# Altium schematic sheet power.SchDoc
size 381 x 241 mm
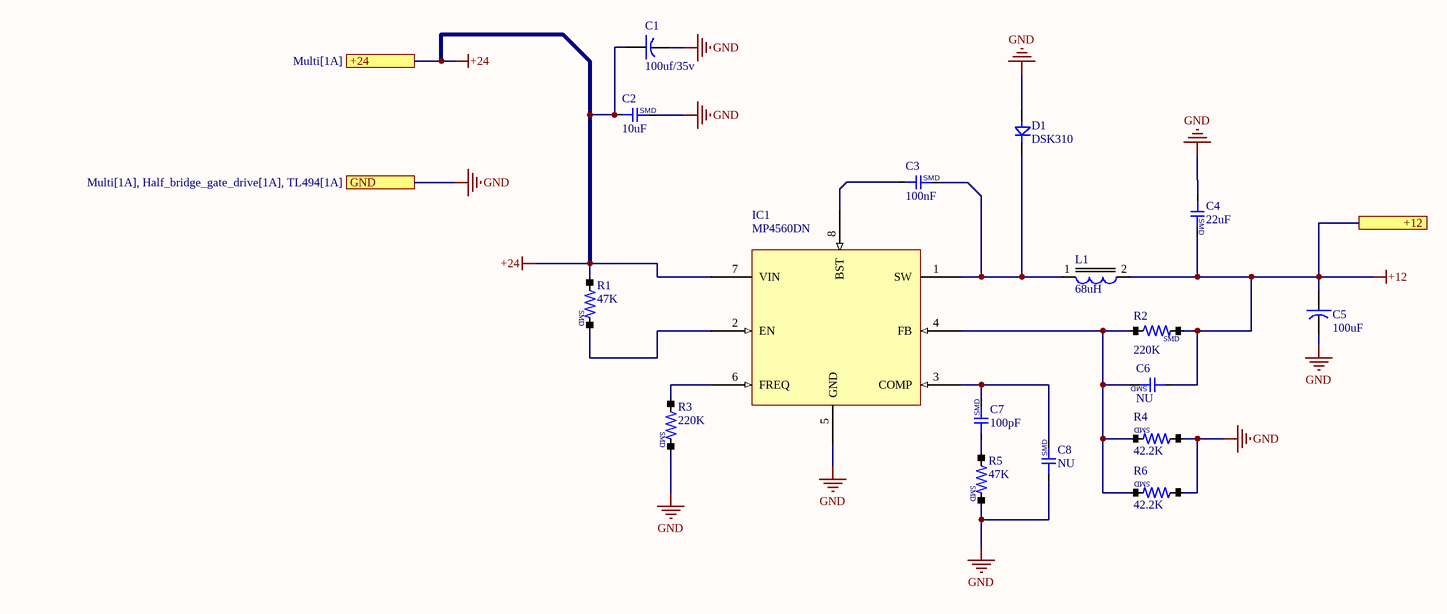
[diagram p0: power.SchDoc]

## Parts
C1  100uf/35v  [cap/330u/16v]
C2  10uF  [CAP-1206]
C3  100nF  [CAP-0603]
C4  22uF  [CAP-1206]
C5  100uF  [cap/330u/16v]
C6  NU  [CAP-0603]
C7  100pF  [CAP-0603]
C8  NU  [CAP-0603]
D1  DSK310  [DIOD/1N4007/SMD]
IC1  MP4560DN  [SOP8_HIT]
L1  68uH  [NR6028T680]
R1  47K  [RES/0603]
R2  220K  [RES/0603]
R3  220K  [RES/0603]
R4  42.2K  [RES/0603]
R5  47K  [RES/0603]
R6  42.2K  [RES/0603]

## Ports
+12, +24 (see Multi[1A]), GND (see Multi[1A], Half_bridge_gate_drive[1A], TL494[1A])

## Nets
+12: C4.2 C5.+ C6.1 L1.2 R2.2 ; port +12
+24: C1.+ C2.1 IC1.7(VIN) R1.1 ; port +24
GND: C1.- C2.2 C4.1 C5.- C8.1 D1.A IC1.5(GND) R3.2 R4.1 R5.2 R6.1 ; port GND
NetC3_1: C3.1 IC1.8(BST)
NetC3_2: C3.2 D1.K IC1.1(SW) L1.1
NetC6_2: C6.2 IC1.4(FB) R2.1 R4.2 R6.2
NetC7_1: C7.1 R5.1
NetC7_2: C7.2 C8.2 IC1.3(COMP)
NetIC1_2: IC1.2(EN) R1.2
NetIC1_6: IC1.6(FREQ) R3.1

## Notes on the sheet
- (in symbol cap_smd) SMD
- (in symbol RES/SMD) SMD

## Library data of the parts
C1 C5 = cap-electrolit
C2-C4 C6-C8 = cap_smd
D1 = DIOD/RECTIFIERS
L1 = inductor
R1-R6 = RES/SMD